# EAGLE design prox_board_rotate (EAGLE 8.2.2)
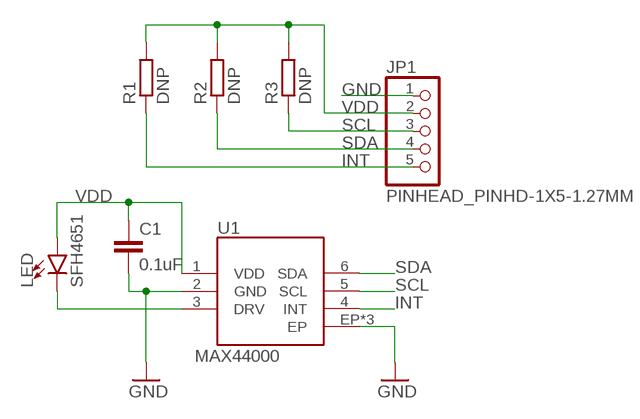
[diagram p0: schematic, sheet 1]

## Parts
C1  0.1uF  C-EUC0603  [C0603]
JP1  PINHEAD_PINHD-1X5-1.27MM  [PINHEAD_1X05-1.27MM]
LED  SFH4651  [MIDLED]
R1  DNP  R-EU_R0603  [R0603]
R2  DNP  R-EU_R0603  [R0603]
R3  DNP  R-EU_R0603  [R0603]
U1  MAX44000  [6OTDFN-EP]

## Nets
GND: C1.2 JP1.1 U1.2(GND) U1.EP U1.P$1(EP) U1.P$2(EP)
INT: JP1.5 R1.1 U1.4(INT)
N$1: LED.C U1.3(DRV)
SCL: JP1.3 R3.1 U1.5(SCL)
SDA: JP1.4 R2.1 U1.6(SDA)
VDD: C1.1 JP1.2 LED.A R1.2 R2.2 R3.2 U1.1(VDD)

## Library data of the parts
C1 = resistor:C-EU: CAPACITOR, European symbol
JP1 = Wisp5_Harvester_Motor-driver_V2:PINHEAD_PINHD-1X5-1.27MM
LED = Wisp5_Harvester_Motor-driver_V2:SFH4651
R1-R3 = resistor:R-EU_: RESISTOR, European symbol
U1 = Wisp5_Harvester_Motor-driver_V2:MAX44000

## Board
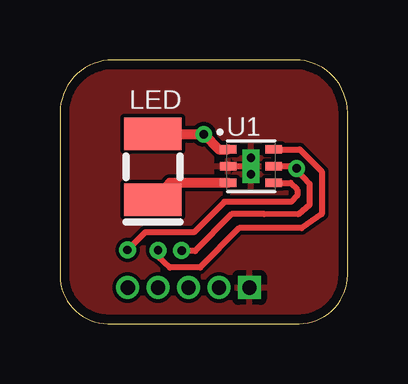
[diagram p1: board, top side]
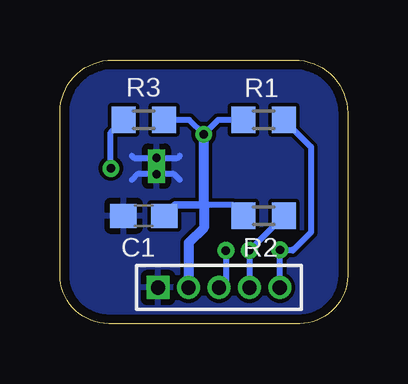
[diagram p2: board, bottom side, seen from below]

Size 12 x 11 mm. Coordinates in mm from the lower left corner, seen from the top.
Outline: 9.81,11 2.22,11 arc90 0,8.78 0,2 arc90 2,0 9.96,0 arc90 12,2.04 12,8.81 arc90 9.81,11
Copper layers (1*16): Top 0.0356mm / dielectric 1.5011mm / Bottom 0.0356mm
Design rules "LaenPCBOrder *": minimum track width 6mil, minimum drill 13mil, track to track 6mil, track to pad 6mil, pad to pad 6mil, via to via 6mil, smd to smd 6mil, copper to edge 15mil, drill to drill 6mil, minimum pad ring 7mil, minimum via ring 7mil, stop-mask expansion 3mil, vias tented up to drill 14mil, thermal gap 10mil

### Footprints (pad centres in the part's own frame; a part is rotated, then mirrored left to right if it is on the bottom)
C0603 = smd 1.1 x 1: 1 -0.85,0; 2 0.85,0
PINHEAD_1X05-1.27MM = drill 0.6 square: 1 -2.54,0 | drill 0.6: 2 -1.27,0; 3 0,0; 4 1.27,0; 5 2.54,0
MIDLED = smd 2.4 x 1.35: A 0,1.375; C 0,-1.375
R0603 = smd 1 x 1.1: 1 -0.85,0; 2 0.85,0
6OTDFN-EP = smd 0.68 x 0.36: 1 0.05,1.7; 2 0.05,1; 3 0.05,0.3; 4 1.95,0.3; 5 1.95,1; 6 1.95,1.7 | smd 0.71 x 1.4: EP 1,1 | drill 0.35 pad 0.71 square: P$1 1,1.34; P$2 1,0.66

### Placement (x,y rotation side)
C1  8.5,4.5 180 bottom
JP1  5.37,1.5 0 bottom
LED  3.88,6.54 0 top
R1  3.5,8.5 180 bottom
R2  3.5,4.5 180 bottom
R3  8.5,8.5 0 bottom
U1  6.97,5.57 0 top

### Tracks (layer width: path | path; a pad name or v marks a point on that pad's centre or on a via)
GND
  Top 0.254: U1.2 U1.EP
  Bottom 0.254: 9,7 8.91,6.91 U1.P$1 7.09,6.91 7,7 | 7,6 7.23,6.23 U1.P$2 8.77,6.23 9,6
  pour Bottom: 0,8.81 0,2.04 arc90 2.04,0 9.95,0 arc90 12,2.05 12,8.78 arc90 9.78,11 2.19,11 arc90
  pour Top: 2.15,0 10.3,0 arc90 11.94,1.64 11.94,8.77 arc90 9.79,10.92 2.15,10.92 arc90 0,8.77 0,2.15 arc90
INT  (via drill 0.35)
  Top 0.254: U1.4 9.62,5.87 9.91,5.59 9.91,5.33 9.65,5.08 6.86,5.08 5.59,3.81 3.56,3.81 v2.82,3.07 2.79,3.05
  Bottom 0.254: JP1.5 v2.82,3.07 2.31,3.07 2.29,3.05 1.52,3.81 1.52,7.37 R1.1
N$1
  Top 0.406: U1.3 4.58,5.87 LED.C
SCL  (via drill 0.35)
  Top 0.254: U1.5 9.81,6.57 v9.88,6.48 9.9,6.38 10.41,5.84 10.41,4.95 9.94,4.56 8.52,4.57 7.16,4.57 5.64,3.02 5.11,3.02 v5.08,3.05
  Bottom 0.254: v9.88,6.48 9.88,7.97 R3.1 | v5.08,3.05 5.08,1.79 JP1.3
SDA  (via drill 0.35)
  Top 0.254: U1.6 10,7.27 10.92,6.35 10.92,4.57 10.08,3.99 7.47,3.99 5.85,2.34 4.59,2.34 4.09,2.79 v4.09,3.05 4.07,3.06 v4.09,3.06
  Bottom 0.254: R2.1 v4.09,3.06 JP1.4
VDD  (via drill 0.35)
  Top 0.254: LED.A 3.9,7.9
  Top 0.406: 3.9,7.9 v6,7.9 6.63,7.27 U1.1
  Bottom 0.254: 6.11,8 v6,7.9 | 6.08,5.03 6,4.95 4.8,4.95 R2.2 | v6,7.9 6.6,8.5 R3.2 | R1.2 5.4,8.5 v6,7.9
  Bottom 0.305: C1.1 7.2,4.95 6,4.95
  Bottom 0.406: 6,8 v6,7.9 6,4.95 6,4 6.63,3.37 JP1.2

### Text on the board
tNames: LED